# Altium schematic sheet WireTest.SchDoc
size D
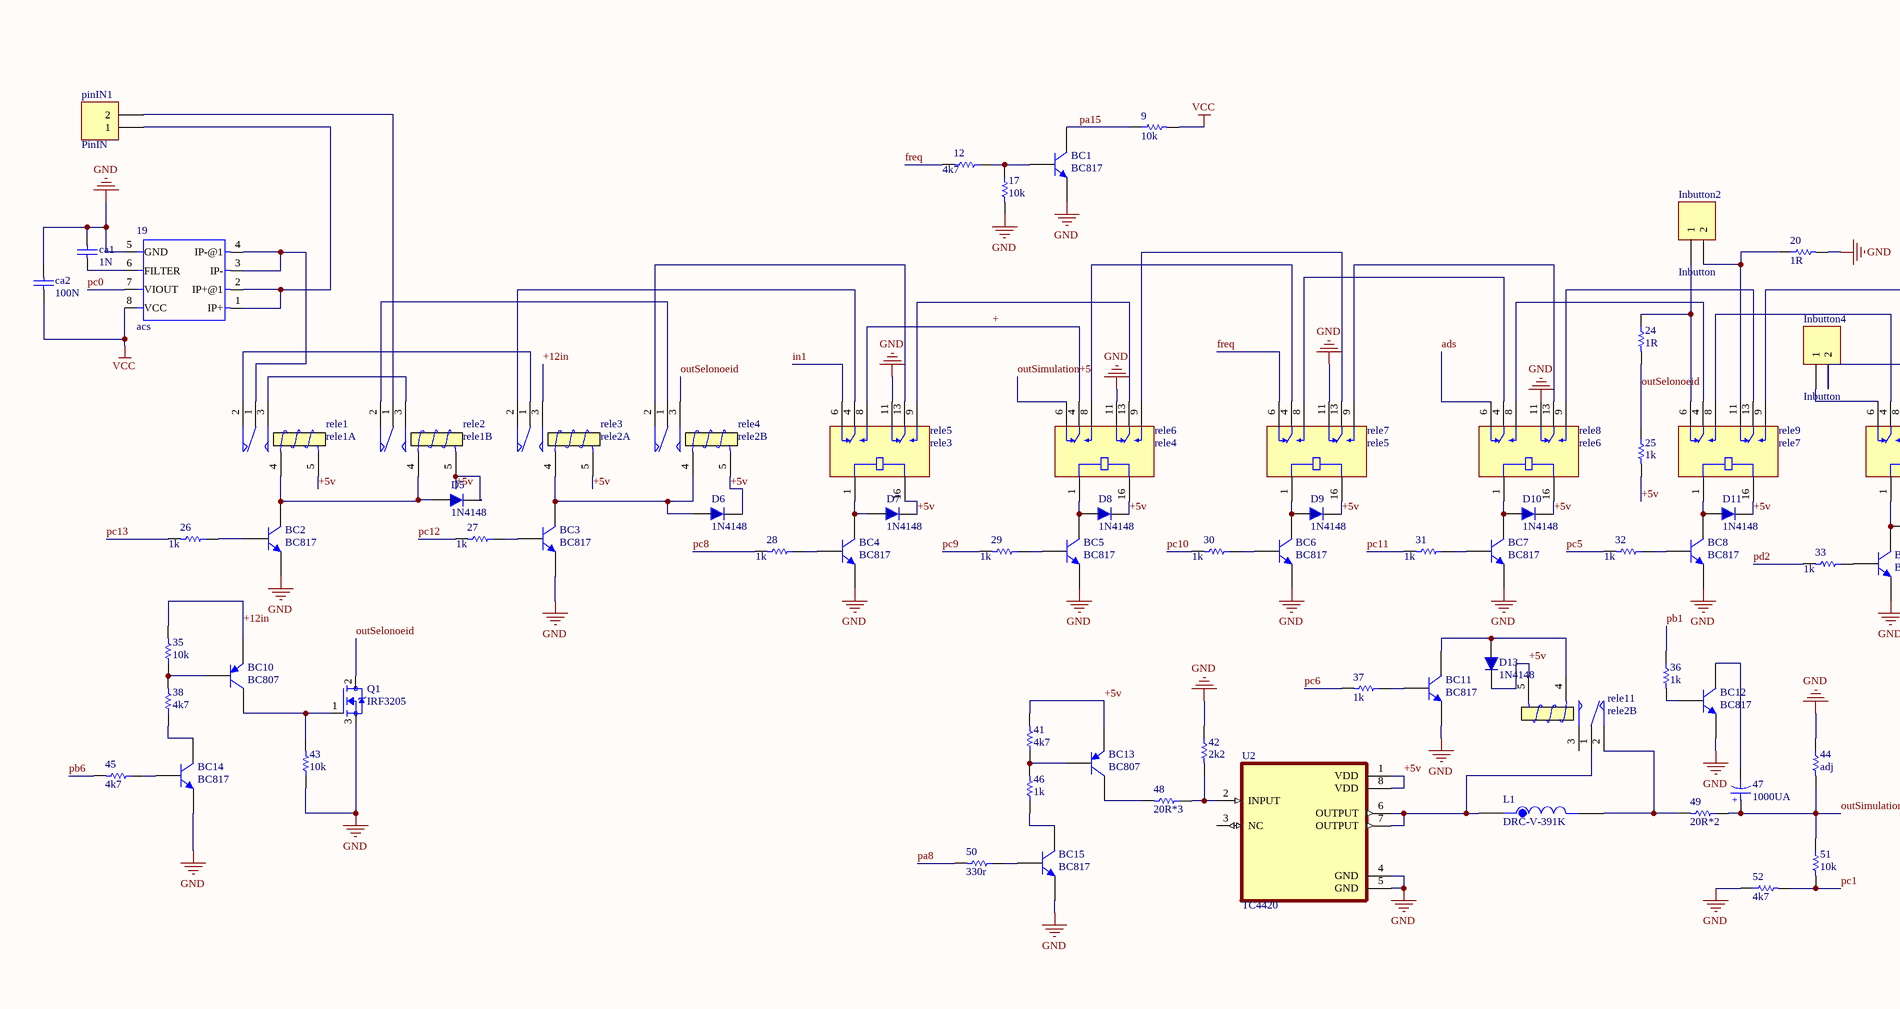
[diagram p0: WireTest.SchDoc, top left]
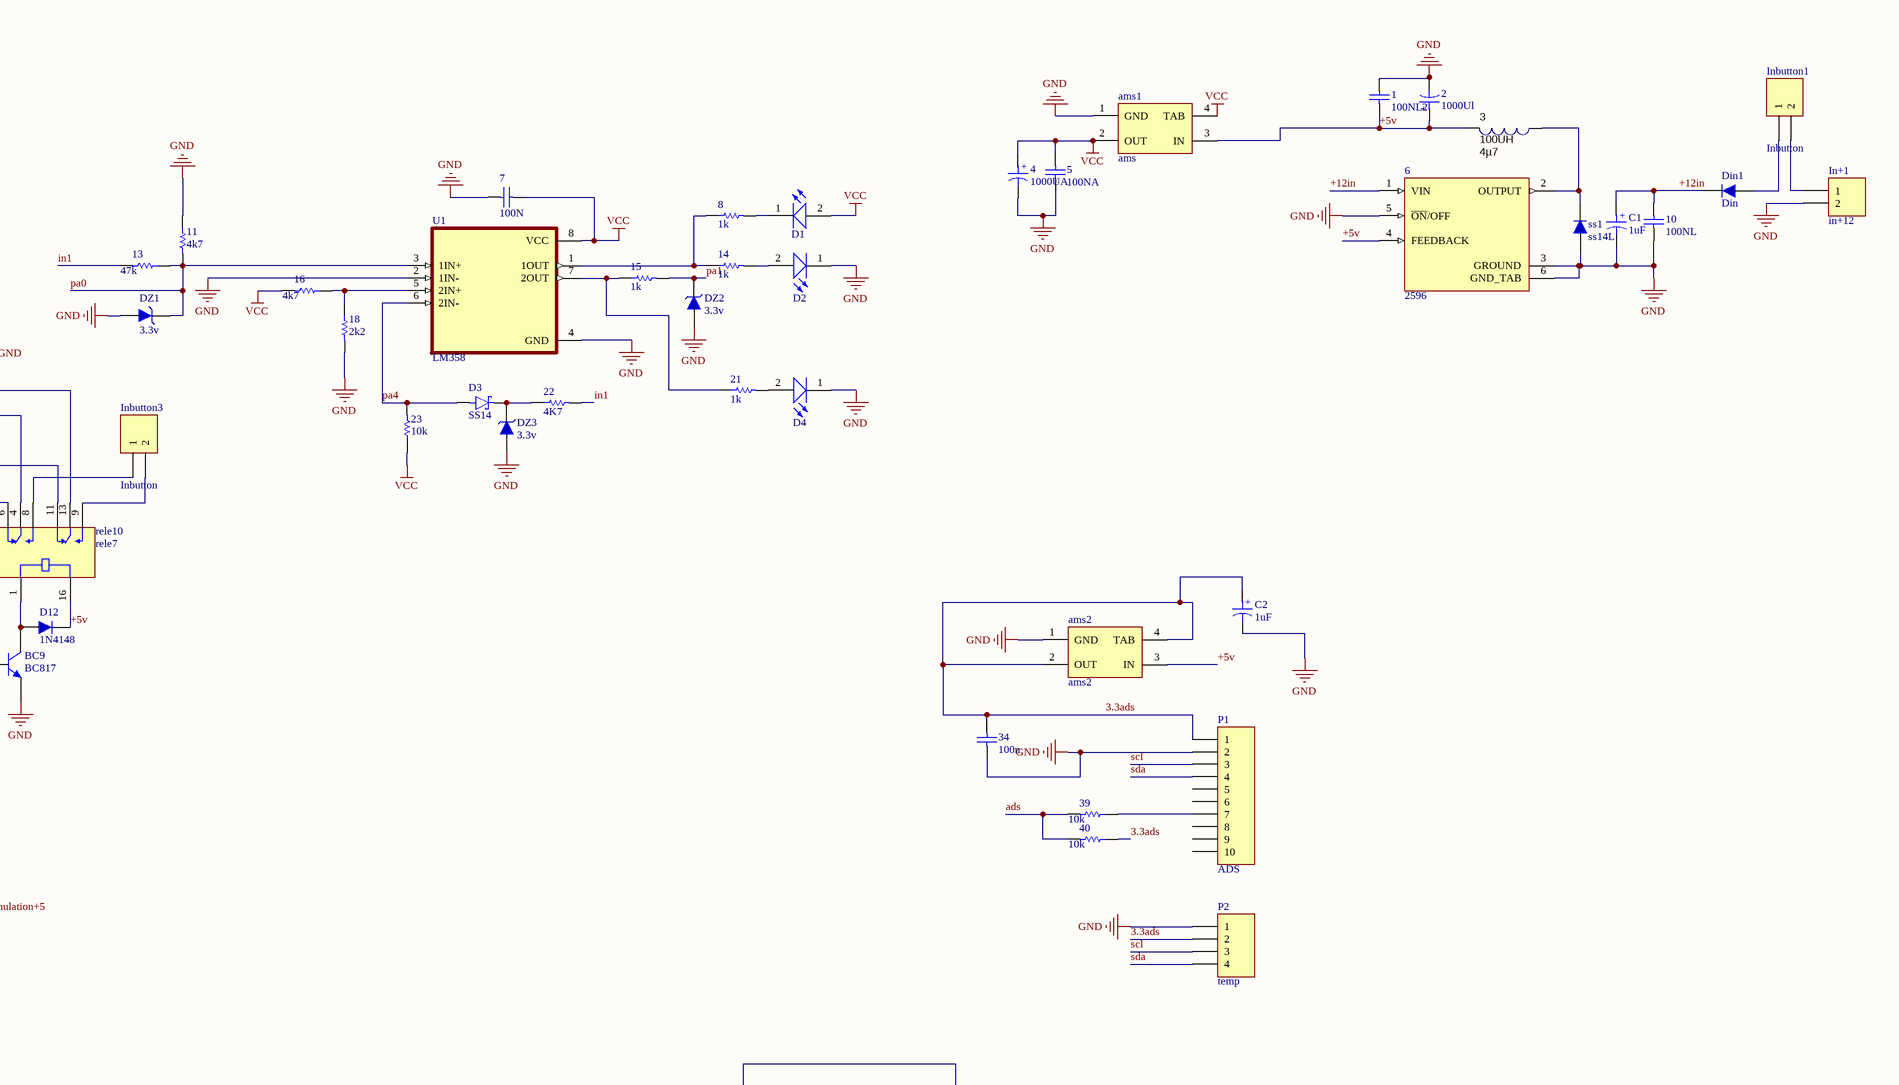
[diagram p1: WireTest.SchDoc, top right]
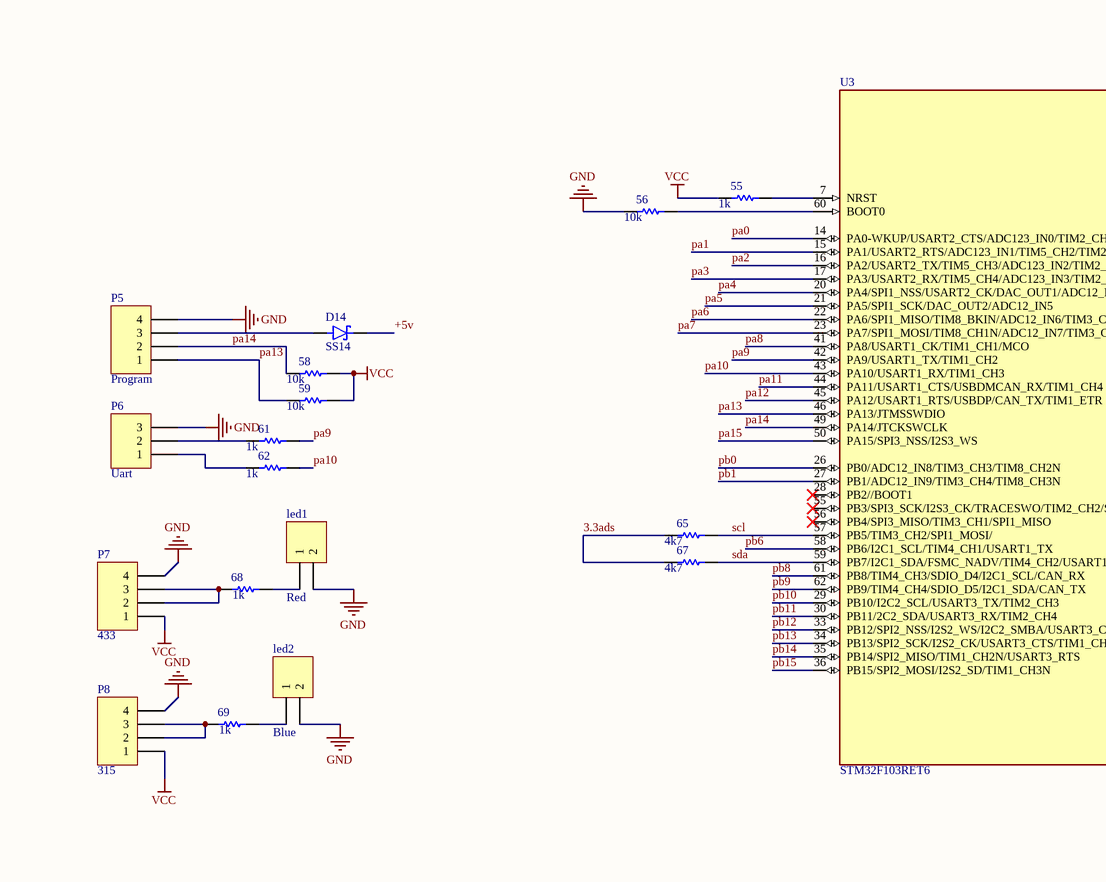
[diagram p2: WireTest.SchDoc, bottom left]
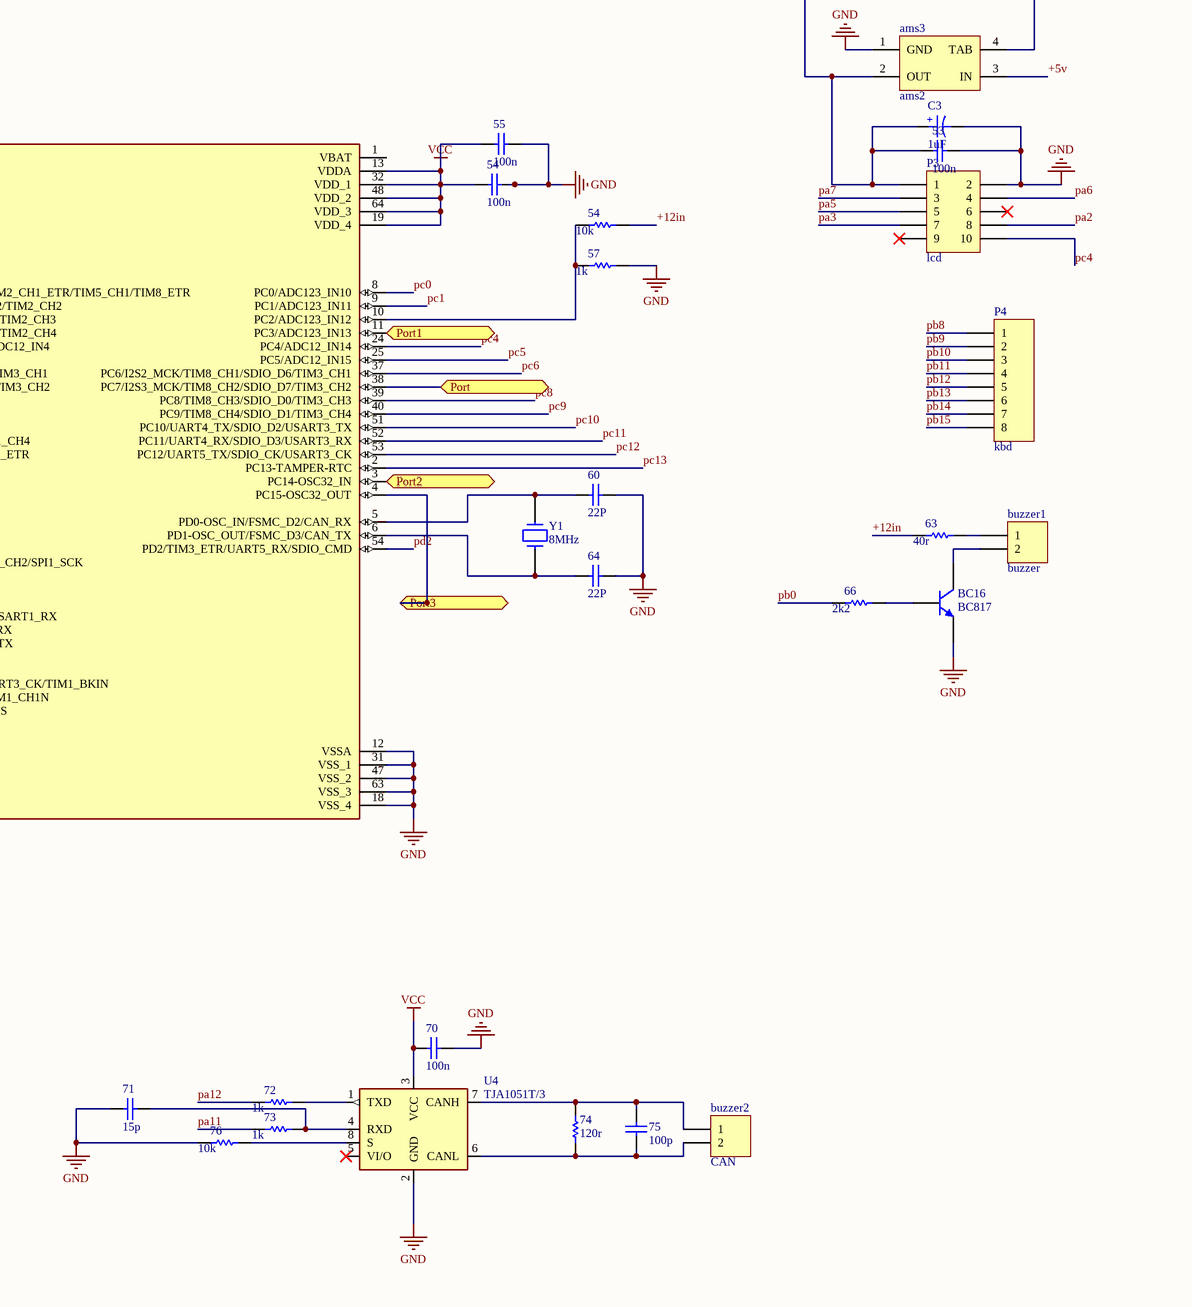
[diagram p3: WireTest.SchDoc, bottom right]

## Parts
(Parts that share a designator on the sheet are numbered #1, #2 ... from top to bottom, then left to right.)
1  100NL2  [CAPC3413X12N]
2  1000Ul  [Cap electrolitic radial 8x12-3.5]
3  100UH  value 4µ7  [Inductor SMD 3x3.2mm]
4  1000UA  [Cap electrolitic radial 8x12-3.5]
5  100NA  [CAPC3413X12N]
6  2596  [TO170P1524X483-6N]
7  100N  [CAPC3413X12N]
8  1k  [RESC4817X04N]
9  10k  [RESC4817X04N]
10  100NL  [CAPC3413X12N]
11  4k7  [RESC4817X04N]
12  4k7  [RESC4817X04N]
13  47k  [RESC4817X04N]
14  1k  [RESC4817X04N]
15  1k  [RESC4817X04N]
16  4k7  [RESC4817X04N]
17  10k  [RESC4817X04N]
18  2k2  [RESC4817X04N]
19  acs  [SOIC8-1.27-5X4MM]
20  1R  [RESC4817X04N]
21  1k  [RESC4817X04N]
22  4K7  [RESC4817X04N]
23  10k  [RESC4817X04N]
24  1R  [RESC4817X04N]
25  1k  [RESC4817X04N]
26  1k  [RESC4817X04N]
27  1k  [RESC4817X04N]
28  1k  [RESC4817X04N]
29  1k  [RESC4817X04N]
30  1k  [RESC4817X04N]
31  1k  [RESC4817X04N]
32  1k  [RESC4817X04N]
33  1k  [RESC4817X04N]
34  100n  [CAPC3413X12N]
35  10k  [RESC4817X04N]
36  1k  [RESC4817X04N]
37  1k  [RESC4817X04N]
38  4k7  [RESC4817X04N]
39  10k  [RESC4817X04N]
40  10k  [RESC4817X04N]
41  4k7  [RESC4817X04N]
42  2k2  [RESC4817X04N]
43  10k  [RESC4817X04N]
44  adj  [RESC4817X04N]
45  4k7  [RESC4817X04N]
46  1k  [RESC4817X04N]
47  1000UA  [Cap electrolitic radial 8x12-3.5]
48  20R*3  [RESC4817X04N]
49  20R*2  [RESC4817X04N]
50  330r  [RESC4817X04N]
51  10k  [RESC4817X04N]
52  4k7  [RESC4817X04N]
53  100n  [CAPC3413X12N]
54#1  100n  [CAPC3413X12N]
54#2  10k  [RESC4817X04N]
55#1  100n  [CAPC3413X12N]
55#2  1k  [RESC4817X04N]
56  10k  [RESC4817X04N]
57  1k  [RESC4817X04N]
58  10k  [RESC4817X04N]
59  10k  [RESC4817X04N]
60  22P  [CAPC3413X12N]
61  1k  [RESC4817X04N]
62  1k  [RESC4817X04N]
63  40r  [RESC4817X04N]
64  22P  [CAPC3413X12N]
65  4k7  [RESC4817X04N]
66  2k2  [RESC4817X04N]
67  4k7  [RESC4817X04N]
68  1k  [RESC4817X04N]
69  1k  [RESC4817X04N]
70  100n  [CAPC3413X12N]
71  15p  [CAPC3413X12N]
72  1k  [RESC4817X04N]
73  1k  [RESC4817X04N]
74  120r  [RESC4817X04N]
75  100p  [CAPC3413X12N]
76  10k  [RESC4817X04N]
ams1  ams  [MP04A_N]
ams2  ams2  [MP04A_N]
ams3  ams2  [MP04A_N]
BC1  BC817  [SOT23_N]
BC2  BC817  [SOT23_N]
BC3  BC817  [SOT23_N]
BC4  BC817  [SOT23_N]
BC5  BC817  [SOT23_N]
BC6  BC817  [SOT23_N]
BC7  BC817  [SOT23_N]
BC8  BC817  [SOT23_N]
BC9  BC817  [SOT23_N]
BC10  BC807  [SOT23_BEC_N]
BC11  BC817  [SOT23_N]
BC12  BC817  [SOT23_N]
BC13  BC807  [SOT23_BEC_N]
BC14  BC817  [SOT23_N]
BC15  BC817  [SOT23_N]
BC16  BC817  [SOT23_N]
buzzer1  buzzer  [HDR1X2]
buzzer2  CAN  [HDR1X2]
C1  1uF  [Cap electrolitic radial 8x12-3.5]
C2  1uF  [Cap1206_(3216X18L)Size A]
C3  1uF  [Cap1206_(3216X18L)Size A]
ca1  1N  [CAPC3413X12N]
ca2  100N  [CAPC3413X12N]
D1  led-  [LED_SMD_0805]  (value not drawn)
D2  led+  [LED_SMD_0805]  (value not drawn)
D3  SS14  [DIOM4325X250N]
D4  led_r  [LED_SMD_0805]  (value not drawn)
D5  1N4148  [Diode 1n4148 SMD]
D6  1N4148  [Diode 1n4148 SMD]
D7  1N4148  [Diode 1n4148 SMD]
D8  1N4148  [Diode 1n4148 SMD]
D9  1N4148  [Diode 1n4148 SMD]
D10  1N4148  [Diode 1n4148 SMD]
D11  1N4148  [Diode 1n4148 SMD]
D12  1N4148  [Diode 1n4148 SMD]
D13  1N4148  [Diode 1n4148 SMD]
D14  SS14  [DIOM4325X250N]
Din1  Din  [Diode 1W Stand]
DZ1  3.3v  [SOD80, LL-34]
DZ2  3.3v  [SOD80, LL-34]
DZ3  3.3v  [SOD80, LL-34]
In+1  in+12  [HDR1X2]
Inbutton1  Inbutton  [HDR1X2]
Inbutton2  Inbutton  [HDR1X2]
Inbutton3  Inbutton  [HDR1X2]
Inbutton4  Inbutton  [HDR1X2]
L1  DRC-V-391K  [IND_DRC-V-391K]
led1  Red  [HDR1X2]
led2  Blue  [HDR1X2]
P1  ADS  [HDR1X10]
P2  temp  [HDR1X4]
P3  lcd  [HDR2X5]
P4  kbd  [HDR1X8]
P5  Program  [HDR1X4]
P6  Uart  [HDR1X3]
P7  433  [HDR1X4]
P8  315  [HDR1X4]
pinIN1  PinIN  [HDR1X2]
Q1  IRF3205  [TO254P1067X483X3124-3P]
rele1  rele1A  [Relay 15.40x12.10x13.10]
rele2  rele1B  [Relay 15.40x12.10x13.10]
rele3  rele2A  [Relay 15.40x12.10x13.10]
rele4  rele2B  [Relay 15.40x12.10x13.10]
rele5  rele3  [RELAY_9-1393792-3]
rele6  rele4  [RELAY_9-1393792-3]
rele7  rele5  [RELAY_9-1393792-3]
rele8  rele6  [RELAY_9-1393792-3]
rele9  rele7  [RELAY_9-1393792-3]
rele10  rele7  [RELAY_9-1393792-3]
rele11  rele2B  [Relay 15.40x12.10x13.10]
ss1  ss14L  [Diode 1N4007 SMD]
U1  LM358  [SOIC127P599X175-8N]
U2  TC4420  [DIP787W46P254L927H533Q8]
U3  STM32F103RET6  [QFP50P1200X1200X160-64N]
U4  TJA1051T/3  [SOT96-1]
Y1  8MHz  [My_Crystal]

## Ports
Port, Port1, Port2, Port3

## Nets
GND: 1.2 2.2 4.2 5.1 6.3(GROUND) 6.5(~{ON}/OFF) 6.6(GND_TAB) 7.2 10.1 11.1 17.2 18.2 19.5(GND) 20.2 34.2 42.1 43.1 44.1 52.1 53.2 54#1.2 55#1.2 56.2 57.1 60.1 64.1 70.1 71.2 76.2 ams1.1(GND) ams2.1(GND) ams3.1(GND) BC1.2(E) BC2.2(E) BC3.2(E) BC4.2(E) BC5.2(E) BC6.2(E) BC7.2(E) BC8.2(E) BC9.2(E) BC11.2(E) BC12.2(E) BC14.2(E) BC15.2(E) BC16.2(E) C1.2 C2.2 C3.2 ca1.1 ca2.1 D2.1(K) D4.1(K) DZ1.1 DZ2.1 DZ3.1 In+1.2 led1.2 led2.2 P1.2 P2.1 P3.2 P5.4 P6.3 P7.4 P8.4 Q1.3(S) rele5.11(NC2) rele6.11(NC2) rele7.11(NC2) rele8.11(NC2) ss1.1 U1.2(1IN-) U1.4(GND) U2.4(GND) U2.5(GND) U3.12(VSSA) U3.18(VSS_4) U3.31(VSS_1) U3.47(VSS_2) U3.63(VSS_3) U4.2(GND)
VCC: 4.1 5.2 7.1 9.2 16.2 19.8(VCC) 23.1 54#1.1 55#1.1 55#2.2 58.1 59.1 70.2 ams1.2(OUT) ams1.4(TAB) ca2.2 D1.2(A) P7.1 P8.1 U1.8(VCC) U3.13(VDDA) U3.19(VDD_4) U3.32(VDD_1) U3.48(VDD_2) U3.64(VDD_3) U4.3(VCC)
3.3ads: 34.1 40.1 65.2 67.2 ams2.2(OUT) ams2.4(TAB) C2.1 P1.1 P2.2
+: rele5.8(NO1) rele6.4(COM1)
+5v: 1.1 2.1 3.2 6.4(FEEDBACK) 25.2 41.2 ams1.3(IN) ams2.3(IN) ams3.3(IN) BC13.2(E) D5.2 D6.2 D7.2 D8.2 D9.2 D10.2 D11.2 D12.2 D13.2 D14.C(K) rele1.5(T2) rele2.5(T2) rele3.5(T2) rele4.5(T2) rele5.16(COIL2) rele6.16(COIL2) rele7.16(COIL2) rele8.16(COIL2) rele9.16(COIL2) rele10.16(COIL2) rele11.5(T2) U2.1(VDD) U2.8(VDD)
+12in: 6.1(VIN) 10.2 35.2 54#2.1 63.2 BC10.2(E) C1.1 Din1.2 rele3.3(NO)
ads: 39.2 40.2 rele8.6(NC1)
freq: 12.2 rele7.6(NC1)
in1: 13.2 22.2 rele5.6(NC1)
outSelonoeid: 24.2 25.1 Q1.2(D) rele4.3(NO)
outSimulation+5: 44.2 47.1 49.1 51.1 rele6.6(NC1)
pa0: 11.2 13.1 DZ1.2 U1.3(1IN+) U3.14(PA0-WKUP/USART2_CTS/ADC123_IN0/TIM2_CH1_ETR/TIM5_CH1/TIM8_ETR)
pa1: 15.2 DZ2.2 U3.15(PA1/USART2_RTS/ADC123_IN1/TIM5_CH2/TIM2_CH2)
pa2: P3.8 U3.16(PA2/USART2_TX/TIM5_CH3/ADC123_IN2/TIM2_CH3)
pa3: P3.7 U3.17(PA3/USART2_RX/TIM5_CH4/ADC123_IN3/TIM2_CH4)
pa4: 23.2 D3.A U1.6(2IN-) U3.20(PA4/SPI1_NSS/USART2_CK/DAC_OUT1/ADC12_IN4)
pa5: P3.5 U3.21(PA5/SPI1_SCK/DAC_OUT2/ADC12_IN5)
pa6: P3.4 U3.22(PA6/SPI1_MISO/TIM8_BKIN/ADC12_IN6/TIM3_CH1)
pa7: P3.3 U3.23(PA7/SPI1_MOSI/TIM8_CH1N/ADC12_IN7/TIM3_CH2)
pa8: 50.2 U3.41(PA8/USART1_CK/TIM1_CH1/MCO)
pa9: 61.1 U3.42(PA9/USART1_TX/TIM1_CH2)
pa10: 62.1 U3.43(PA10/USART1_RX/TIM1_CH3)
pa11: 73.2 U3.44(PA11/USART1_CTS/USBDMCAN_RX/TIM1_CH4)
pa12: 72.2 U3.45(PA12/USART1_RTS/USBDP/CAN_TX/TIM1_ETR)
pa13: 59.2 P5.1 U3.46(PA13/JTMSSWDIO)
pa14: 58.2 P5.2 U3.49(PA14/JTCKSWCLK)
pa15: 9.1 BC1.3(C) U3.50(PA15/SPI3_NSS/I2S3_WS)
pb0: 66.2 U3.26(PB0/ADC12_IN8/TIM3_CH3/TIM8_CH2N)
pb1: 36.1 U3.27(PB1/ADC12_IN9/TIM3_CH4/TIM8_CH3N)
pb6: 45.2 U3.58(PB6/I2C1_SCL/TIM4_CH1/USART1_TX)
pb8: P4.1 U3.61(PB8/TIM4_CH3/SDIO_D4/I2C1_SCL/CAN_RX)
pb9: P4.2 U3.62(PB9/TIM4_CH4/SDIO_D5/I2C1_SDA/CAN_TX)
pb10: P4.3 U3.29(PB10/I2C2_SCL/USART3_TX/TIM2_CH3)
pb11: P4.4 U3.30(PB11/2C2_SDA/USART3_RX/TIM2_CH4)
pb12: P4.5 U3.33(PB12/SPI2_NSS/I2S2_WS/I2C2_SMBA/USART3_CK/TIM1_BKIN)
pb13: P4.6 U3.34(PB13/SPI2_SCK/I2S2_CK/USART3_CTS/TIM1_CH1N)
pb14: P4.7 U3.35(PB14/SPI2_MISO/TIM1_CH2N/USART3_RTS)
pb15: P4.8 U3.36(PB15/SPI2_MOSI/I2S2_SD/TIM1_CH3N)
pc0: 19.7(VIOUT) U3.8(PC0/ADC123_IN10)
pc1: 51.2 52.2 U3.9(PC1/ADC123_IN11)
pc4: P3.10 U3.24(PC4/ADC12_IN14)
pc5: 32.2 U3.25(PC5/ADC12_IN15)
pc6: 37.2 U3.37(PC6/I2S2_MCK/TIM8_CH1/SDIO_D6/TIM3_CH1)
pc8: 28.2 U3.39(PC8/TIM8_CH3/SDIO_D0/TIM3_CH3)
pc9: 29.2 U3.40(PC9/TIM8_CH4/SDIO_D1/TIM3_CH4)
pc10: 30.2 U3.51(PC10/UART4_TX/SDIO_D2/USART3_TX)
pc11: 31.2 U3.52(PC11/UART4_RX/SDIO_D3/USART3_RX)
pc12: 27.2 U3.53(PC12/UART5_TX/SDIO_CK/USART3_CK)
pc13: 26.2 U3.2(PC13-TAMPER-RTC)
pd2: 33.2 U3.54(PD2/TIM3_ETR/UART5_RX/SDIO_CMD)
Port: U3.38(PC7/I2S3_MCK/TIM8_CH2/SDIO_D7/TIM3_CH2) ; port Port
Port1: U3.11(PC3/ADC123_IN13) ; port Port1
Port2: U3.3(PC14-OSC32_IN) ; port Port2
Port3: U3.4(PC15-OSC32_OUT) ; port Port3
scl: 65.1 P1.3 P2.3 U3.57(PB5/TIM3_CH2/SPI1_MOSI/)
sda: 67.1 P1.4 P2.4 U3.59(PB7/I2C1_SDA/FSMC_NADV/TIM4_CH2/USART1_RX)
Net3_1: 3.1 6.2(OUTPUT) ss1.2
Net8_1: 8.1 14.1 U1.1(1OUT)
Net8_2: 8.2 D1.1(K)
Net12_1: 12.1 17.1 BC1.1(B)
Net14_2: 14.2 D2.2(A)
Net15_1: 15.1 21.1 U1.7(2OUT)
Net16_1: 16.1 18.1 U1.5(2IN+)
Net19_1: 19.1(IP+) 19.2(IP+@1) pinIN1.1
Net19_3: 19.3(IP-) 19.4(IP-@1) rele1.1(COM)
Net19_6: 19.6(FILTER) ca1.2
Net20_1: 20.1 Inbutton2.2 rele9.11(NC2)
Net21_2: 21.2 D4.2(A)
Net22_1: 22.1 D3.C(K) DZ3.2
Net24_1: 24.1 Inbutton2.1 rele9.6(NC1)
Net26_1: 26.1 BC2.1(B)
Net27_1: 27.1 BC3.1(B)
Net28_1: 28.1 BC4.1(B)
Net29_1: 29.1 BC5.1(B)
Net30_1: 30.1 BC6.1(B)
Net31_1: 31.1 BC7.1(B)
Net32_1: 32.1 BC8.1(B)
Net33_1: 33.1 BC9.1(B)
Net35_1: 35.1 38.2 BC10.1(B)
Net36_2: 36.2 BC12.1(B)
Net37_1: 37.1 BC11.1(B)
Net38_1: 38.1 BC14.3(C)
Net39_1: 39.1 P1.7
Net41_1: 41.1 46.2 BC13.1(B)
Net42_2: 42.2 48.1 U2.2(INPUT)
Net43_2: 43.2 BC10.3(C) Q1.1(G)
Net45_1: 45.1 BC14.1(B)
Net46_1: 46.1 BC15.3(C)
Net47_2: 47.2 BC12.3(C)
Net48_2: 48.2 BC13.3(C)
Net49_2: 49.2 L1.2 rele11.2(NC)
Net50_1: 50.1 BC15.1(B)
Net53_1: 53.1 ams3.2(OUT) ams3.4(TAB) C3.1 P3.1
Net54#2_2: 54#2.2 57.2 U3.10(PC2/ADC123_IN12)
Net55#2_1: 55#2.1 U3.7(NRST)
Net56_1: 56.1 U3.60(BOOT0)
Net60_2: 60.2 U3.5(PD0-OSC_IN/FSMC_D2/CAN_RX) Y1.2
Net61_2: 61.2 P6.2
Net62_2: 62.2 P6.1
Net63_1: 63.1 buzzer1.1
Net64_2: 64.2 U3.6(PD1-OSC_OUT/FSMC_D3/CAN_TX) Y1.1
Net66_1: 66.1 BC16.1(B)
Net68_1: 68.1 led1.1
Net68_2: 68.2 P7.2 P7.3
Net69_1: 69.1 led2.1
Net69_2: 69.2 P8.2 P8.3
Net71_1: 71.1 73.1 U4.4(RXD)
Net72_1: 72.1 U4.1(TXD)
Net74_1: 74.1 75.2 buzzer2.1 U4.7(CANH)
Net74_2: 74.2 75.1 buzzer2.2 U4.6(CANL)
Net76_1: 76.1 U4.8(S)
NetBC2_3: BC2.3(C) D5.1 rele1.4(T1) rele2.4(T1)
NetBC3_3: BC3.3(C) D6.1 rele3.4(T1) rele4.4(T1)
NetBC4_3: BC4.3(C) D7.1 rele5.1(COIL1)
NetBC5_3: BC5.3(C) D8.1 rele6.1(COIL1)
NetBC6_3: BC6.3(C) D9.1 rele7.1(COIL1)
NetBC7_3: BC7.3(C) D10.1 rele8.1(COIL1)
NetBC8_3: BC8.3(C) D11.1 rele9.1(COIL1)
NetBC9_3: BC9.3(C) D12.1 rele10.1(COIL1)
NetBC11_3: BC11.3(C) D13.1 rele11.4(T1)
NetBC16_3: BC16.3(C) buzzer1.2
NetD14_A: D14.A P5.3
NetDin1_1: Din1.1 Inbutton1.1
NetIn+1_1: In+1.1 Inbutton1.2
NetInbutton3_1: Inbutton3.1 rele10.8(NO1)
NetInbutton3_2: Inbutton3.2 rele10.9(NO2)
NetInbutton4_1: Inbutton4.1 rele10.6(NC1)
NetInbutton4_2: Inbutton4.2 rele10.11(NC2)
NetL1_1: L1.1 rele11.1(COM) U2.6(OUTPUT) U2.7(OUTPUT)
NetpinIN1_2: pinIN1.2 rele2.1(COM)
Netrele1_2: rele1.2(NC) rele3.1(COM)
Netrele1_3: rele1.3(NO) rele2.3(NO)
Netrele2_2: rele2.2(NC) rele4.1(COM)
Netrele3_2: rele3.2(NC) rele5.4(COM1)
Netrele4_2: rele4.2(NC) rele5.13(COM2)
Netrele5_9: rele5.9(NO2) rele6.13(COM2)
Netrele6_8: rele6.8(NO1) rele7.4(COM1)
Netrele6_9: rele6.9(NO2) rele7.13(COM2)
Netrele7_8: rele7.8(NO1) rele8.4(COM1)
Netrele7_9: rele7.9(NO2) rele8.13(COM2)
Netrele8_8: rele8.8(NO1) rele9.4(COM1)
Netrele8_9: rele8.9(NO2) rele9.13(COM2)
Netrele9_8: rele9.8(NO1) rele10.4(COM1)
Netrele9_9: rele9.9(NO2) rele10.13(COM2)

Not connected (* = marked no-connect by the designer): P1 5 6 8 9 10; P3 6* 9*; rele11 3(NO); U2 3(NC); U3 1(VBAT) 28(PB2//BOOT1)* 55(PB3/SPI3_SCK/I2S3_CK/TRACESWO/TIM2_CH2/SPI1_SCK)* 56(PB4/SPI3_MISO/TIM3_CH1/SPI1_MISO)*; U4 5(VI/O)*

## Notes on the sheet
- (in symbol Cap ELECTROLITIC TOTAL SIZE) +

## Library data of the parts
1 5 7 10 34 53 54#1 55#1 60 64 70 71 75 ca1 ca2 = CAP SMD 0805: CAP 0805; Designer: Abbas Basereh; Desc.: CAP SMD 0805; Data: 16-12-2016
2 4 47 = Cap ELECTROLITIC TOTAL SIZE: Cap electrolitic radial; Designer: Abbas Basereh; VALUE: 1uF; Data: 16-12-2016; Part. No: *
3 = Inductor 4.7µH SMD 3x3.2mm: Tolerance: ±20%; SCDType: source; Package / Case: Inductor 4.7µH SMD 3x3.2mm; Type: Ferrite Core; Supplier 1: Digi-Key; Operating Temperature: -40°C ~ 125°C
6 = LM2596S-5.0: Value: *; MP: LM2596S-5.0; Package: None; Availability: Unavailable; Price: None
8 9 11-18 20-33 35-46 48-52 54#2 55#2 56-59 61-63 65-69 72-74 76 = RES 1206 0.25W: RES 1206; Designer: Abbas Basereh; Desc.: RES SMD 1206; Data: 16-12-2016
19 = CURRENT-ACS712ELCTR-05B-T(SOIC8-5X4MM): Current Sensor 5A 1 Channel Hall Effect, Open Loop Bidirectional 8-SOIC _0.154, 3.90mm Width_; MF: Allegro; Value: *; SnapEDA_Link: https://www.snapeda.com/parts/ACS712ELCTR-05B-T/Allegro%20Industries/view-part/217679/?ref=snap; Availability: Unavailable; MP: ACS712ELCTR-05B-T; Package: SOIC-8 Allegro MicroSystems LLC; Price: None
ams1-ams3 = LM1117IMP-x.x: x.x Volt, 800mA Low-Dropout Linear Regulator, 4-pin SOT-223; PartNumber: LM1117IMP-3.3; Manufacturer: National Semiconductor; PackageTopMarking: XYTT*N05B; PowerWise: N; CompType: LDO IC; Published: 4-Dec-2008; DatasheetVersion: Apr-2006; PackageVersion: revB, Apr-2003; PackageReference: MP04A; Publisher: Altium Limited; PackageDescription: Molded SOT-223, 6.50 x 3.56 x 1.6mm Body, 4 Lead, 2.3mm Pitch; Supplier 1: Farnell; Supplier Part Number 1: 7614123; RoHS: N; PinCount: 4; Code_JEDEC: TO-261-AA; Code_IPC: SOT223-4; ComponentLink1Description: LM1117 Datasheet; ComponentLink1URL: http://www.national.com/ds/LM/LM1117.pdf; ComponentLink2Description: LM1117 Web Page; ComponentLink2URL: http://www.national.com/pf/LM/LM1117.html; ComponentLink3Description: MP04A Package Page; ComponentLink3URL: http://www.national.com/packaging/folders/mp04a.html
BC1-BC9 BC11 BC12 BC14-BC16 = BC817: 45 V, 500 mA NPN general-purpose transistors; Published: 2017-2-8; LatestRevisionDate: 2017; LatestRevisionNote: IPC-7351 Footprint Added.; DatasheetVersion: 2017; PackageVersion: 2017-2-8; PackageReference: SOT23; Publisher: Abbas Basereh; PackageDescription: 3-Pin SOT-23 Package 0.95 mm Pitch, 2.3 mm Lead Span; ComponentLink1Description: Manufacturer Link; ComponentLink1URL: http://www.nxp.com/; ComponentLink2Description: Datasheet; ComponentLink2URL: http://www.nxp.com/
BC10 BC13 = BC807: PNP General-purpose Transistor; Published: 8-Jun-2000; LatestRevisionDate: 29-May-2009; LatestRevisionNote: IPC-7351 Footprint Added.; PackageVersion: Aug-1999; PackageReference: SOT-23B; Publisher: Altium Limited; PackageDescription: 3-Pin SOT-23 Package 0.95 mm Pitch, 2.4 mm Lead Span
buzzer1 buzzer2 In+1 Inbutton1-Inbutton4 led1 led2 pinIN1 = Header 2: Header, 2-Pin; LatestRevisionDate: 17-Jul-2002; LatestRevisionNote: Re-released for DXP Platform.; Publisher: Altium Limited
C1-C3 = Cap ELECTROLITIC TOTAL SIZE: Cap electrolitic radial; Designer: Abbas Basereh; Data: 16-12-2016; Part. No: *; VALUE: 1uF
D1 D2 D4 = LED SMD PACKAGE: SMD Mono-color Chip LED Waterclear; Part Number: 150080BS75000; Peak Wavelength: 465 nm; Forward Voltage: 3.2 V; Published Date: Jan 2017; Publisher: Ali Hafizi
D5-D13 = 1N4148 SMD: General Semicoductor
Din1 ss1 = Diode DIP Package: Published: 8-Jun-2000; LatestRevisionDate: 17-Jul-2002; LatestRevisionNote: Re-released for DXP Platform.; DatasheetVersion: 1997; Publisher: Altium Limited; PackageDescription: Diode, Axial; Body 3.8 x 1.9 mm (LxDia. max), Lead Dia. 0.53 mm (max); Code_JEDEC: DO-204-AH; ComponentLink1Description: Manufacturer Link; ComponentLink1URL: http://www.fairchildsemi.com/; ComponentLink2Description: Datasheet; ComponentLink2URL: http://www.fairchildsemi.com/ds/1N%2F1N4148.pdf
DZ1-DZ3 = ZENER GENERAL DIODE: DIODE ZENER GENERAL; VALUE: 12V; Published: 2017-1-12; PackageVersion: 2017-1-12; PackageReference: DO 35; Publisher: Abbas Basereh; PackageDescription: DIODE GEN ZENER; ComponentLink1Description: Manufacturer Link; ComponentLink2Description: Datasheet
L1 = DRC-V-391K: Radial Coil Inductor; MF: Bel Fuse; Price: None; SnapEDA_Link: https://www.snapeda.com/parts/DRC-V-391K/Bel+Fuse/view-part/?ref=snap; Purchase-URL: https://pricing.snapeda.com/search/part/DRC-V-391K/?ref=eda; Check_prices: https://www.snapeda.com/parts/DRC-V-391K/Bel+Fuse/view-part/?ref=eda; MP: DRC-V-391K; Value: *; Availability: In Stock; Package: None
P1 = Header 10: Header, 10-Pin; LatestRevisionDate: 17-Jul-2002; LatestRevisionNote: Re-released for DXP Platform.; Publisher: Altium Limited
P2 P5 P7 P8 = Header 4: Header, 4-Pin; LatestRevisionDate: 17-Jul-2002; LatestRevisionNote: Re-released for DXP Platform.; Publisher: Altium Limited
P3 = Header 5X2: Header, 5-Pin, Dual row; LatestRevisionDate: 17-Jul-2002; LatestRevisionNote: Re-released for DXP Platform.; Publisher: Altium Limited
P4 = Header 8: Header, 8-Pin; LatestRevisionDate: 17-Jul-2002; LatestRevisionNote: Re-released for DXP Platform.; Publisher: Altium Limited
P6 = Header 3: Header, 3-Pin; LatestRevisionDate: 17-Jul-2002; LatestRevisionNote: Re-released for DXP Platform.; Publisher: Altium Limited
Q1 = IRF3205PBF: N-Channel 55V 110A _Tc_ 200W _Tc_ Through Hole TO-220AB; MF: Infineon Technologies; Package: TO-220 International Rectifier; MP: IRF3205PBF; Value: *; Availability: Unavailable; Price: None; SnapEDA_Link: https://www.snapeda.com/parts/IRF3205PBF/Infineon%20Technologies/view-part/98571/?ref=snap
rele1-rele4 rele11 = RELAY General: Relay_SPDT POWER NEEDLE; Designer: Ali Hafizi; Company: E.P.I.L; Design_Date: 2011/10/31
rele5-rele10 = V23105A5301A201: Industrial Control, Relays, I/O Modules, spdt, relay, Relays and Accessories; MF: TE Connectivity; MP: V23105-A5301-A201; SnapEDA_Link: https://www.snapeda.com/parts/V23105-A5301-A201/TE+Connectivity+Potter+%2526+Brumfield+Relays/view-part/?ref=snap; Package: None; Value: *; Check_prices: https://www.snapeda.com/parts/V23105-A5301-A201/TE+Connectivity+Potter+%2526+Brumfield+Relays/view-part/?ref=eda
U1 = LM358DRG3: Dual, 30-V, 700-kHz operational amplifier; MF: Texas Instruments; SnapEDA_Link: https://www.snapeda.com/parts/LM358DRG3/Texas+Instruments/view-part/?ref=snap; Package: SOIC-8 Texas Instruments; Value: *; MP: LM358DRG3; Check_prices: https://www.snapeda.com/parts/LM358DRG3/Texas+Instruments/view-part/?ref=eda
U2 = TC4420CPA: Microchip MOSFET Power Driver 6A 4.5 to 18V Non-Inverting 8-Pin PDIP | Microchip Technology Inc. TC4420CPA; SnapEDA_Link: https://www.snapeda.com/parts/TC4420CPA/Microchip/view-part/?ref=snap; Package: DIP-8 Microchip; Value: *; MF: Microchip; MP: TC4420CPA; Check_prices: https://www.snapeda.com/parts/TC4420CPA/Microchip/view-part/?ref=eda
U3 = STM32F103RET6: ARMÂ® CortexÂ®-M3 STM32F1 Microcontroller IC 32-Bit 72MHz 512KB (512K x 8) FLASH 64-LQFP (10x10); MF: STMicroelectronics; SnapEDA_Link: https://www.snapeda.com/parts/STM32F103RET6/STMicroelectronics/view-part/?ref=snap; Package: LQFP-64 STMicroelectronics; Value: *; MP: STM32F103RET6; Check_prices: https://www.snapeda.com/parts/STM32F103RET6/STMicroelectronics/view-part/?ref=eda
U4 = TJA1051T/3: 1/1 ÐŸÑ€Ð¸ÐµÐ¼Ð¾Ð¿ÐµÑ€ÐµÐ´Ð°Ñ‚Ñ‡Ð¸Ðº ÐŸÐ¾Ð»Ð¾Ð²Ð¸Ð½Ð° CANbus 8-SO; MF: NXP USA; Price: None; Availability: In Stock; Purchase-URL: https://pricing.snapeda.com/search/part/TJA1051T/3/?ref=eda; SnapEDA_Link: https://www.snapeda.com/parts/TJA1051T/3/NXP+USA+Inc./view-part/?ref=snap; MP: TJA1051T/3; Value: *; Check_prices: https://www.snapeda.com/parts/TJA1051T/3/NXP+USA+Inc./view-part/?ref=eda; Package: SO-8 NXP Semiconductors
Y1 = CRYSTAL
D3 D14 = SS14: Value: *; Availability: Unavailable; Price: None; Package: None; MP: SS14